# Altium project B100AA Development Kit.PrjPcb (part 1 of 5)
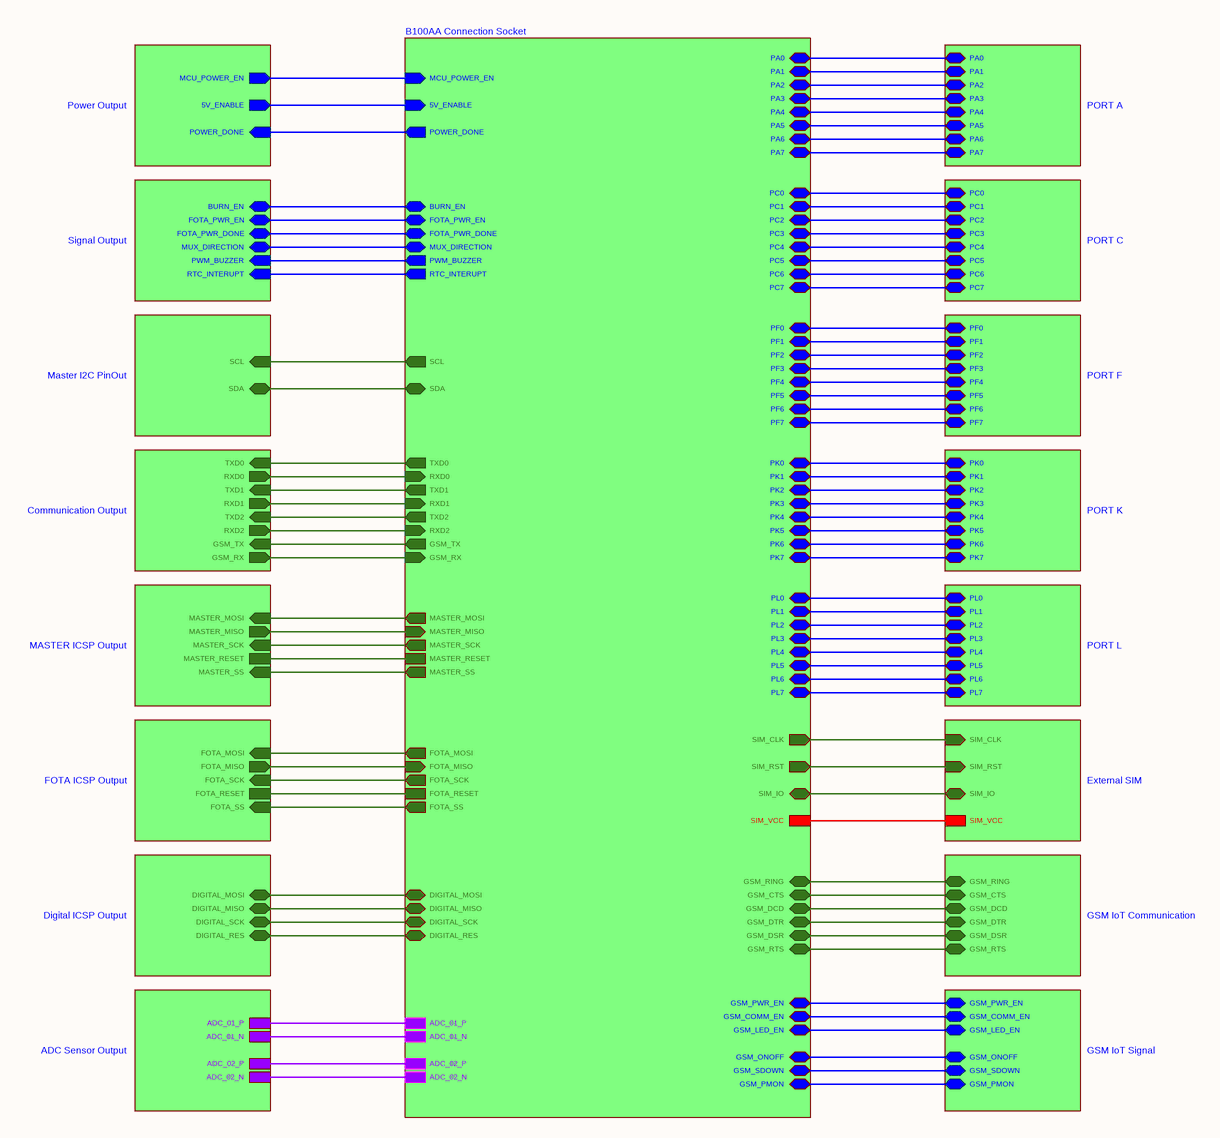
[diagram p0: Block Diagram.SchDoc]
Revision_: B100AA Dev Kit; Organization_: Ovoo Electronics; link: http://www.ovoo.me; Engineer_: Mehmet Günce Akkoyun; DocumentNumber_Prototype_: AA001_Prototype; DocumentNumber_Bulk_: AA001_Bulk; DocumentNumber_: AA001; Address4_: Turkiye; Address3_: Meram / Konya; Address2_: Birgül Apt. No: 19/6; Address1_: Necip Fazýl Mah. Ortaýrmak Sok.
40 sheets, 542 parts. Net scope: hierarchical (ports join the sheet entries above them; power ports are global).
Board file: B100AA DevKit R1.PcbDoc
Sheets:
  Block Diagram.SchDoc
    B100AA Connection Socket = Connection Socket.SchDoc
    PORT A = Digital Port A.SchDoc
      Default State DIP = Digital Port A Default State DIP.SchDoc
      State LED Inducator = Digital Port A State LED Inducator.SchDoc
      State Change Buttons = Digital Port A Button.SchDoc
    PORT C = Digital Port C.SchDoc
      Default State DIP = Digital Port C Default State DIP.SchDoc
      State LED Inducator = Digital Port C State LED Inducator.SchDoc
      State Change Buttons = Digital Port C Button.SchDoc
    PORT F = Digital Port F.SchDoc
      Default State DIP = Digital Port F Default State DIP.SchDoc
      State LED Inducator = Digital Port F State LED Inducator.SchDoc
      State Change Buttons = Digital Port F Button.SchDoc
    PORT K = Digital Port K.SchDoc
      Default State DIP = Digital Port K Default State DIP.SchDoc
      State LED Inducator = Digital Port K State LED Inducator.SchDoc
      State Change Buttons = Digital Port K Button.SchDoc
    PORT L = Digital Port L.SchDoc
      Default State DIP = Digital Port L Default State DIP.SchDoc
      State LED Inducator = Digital Port L State LED Inducator.SchDoc
      State Change Buttons = Digital Port L Button.SchDoc
    External SIM = External SIM Tray.SchDoc
    GSM IoT Communication = GSM Communication Signals.SchDoc
    GSM IoT Signal = GSM Control Signals.SchDoc
    ADC Sensor Output = ADS Sensor Sockets.SchDoc
    Digital ICSP Output = Digital ICSP Test Points.SchDoc
    MASTER ICSP Output = Master MCU ICSP Communication.SchDoc
    Communication Output = UART Communication.SchDoc
    Signal Output = Signal Outputs.SchDoc
    Power Output = Power Network.SchDoc
      Power LED Inducators = Power LED Inducators.SchDoc
      3V3 LDO Regulator = 3V3 LDO Regulator.SchDoc
      Power Test Outputs = Power Test Pins.SchDoc
      External Power Feed = External Power Feed.SchDoc
      Sleep Timer = Sleep Timer.SchDoc
      5V Enable = 5V Enable.SchDoc
      Power Switch = Power Switch.SchDoc
    FOTA ICSP Output = FOTA MCU ICSP Communication.SchDoc
    Master I2C PinOut = I2C PinOut.SchDoc

## Sheet Block Diagram.SchDoc: B100AA Development Kit Block Diagram
size A3; ApprovedBy: Mehmet Günce Akkoyun; CheckedBy: Mehmet Günce Akkoyun; Author: Mehmet Günce Akkoyun; CompanyName: Ovoo Electronics; DrawnBy: Mehmet Günce Akkoyun; Engineer: Mehmet Günce Akkoyun; Organization: Ovoo Electronics; Address1: Necip Fazýl Mah. Ortaýrmak Sok.; Address2: Birgül Apt. No: 19/6; Address3: Meram / Konya; Address4: Turkiye; DocumentNumber: AA001; Revision: B100AA Dev Kit

### Sub-sheets
ADC Sensor Output = ADS Sensor Sockets.SchDoc: ADC_01_N, ADC_02_N, ADC_02_P, ADC_01_P
B100AA Connection Socket = Connection Socket.SchDoc: GSM_COMM_EN (bidir), PC6 (bidir), PF1 (bidir), PF3 (bidir), GSM_CTS (bidir), PF0 (bidir), GSM_TX (out), GSM_RX (in), PA6 (bidir), GSM_PMON (bidir), PK5 (bidir), PF2 (bidir), GSM_RING (bidir), ADC_01_P, PA5 (bidir), PL1 (bidir), PL2 (bidir), GSM_DCD (bidir), GSM_DTR (bidir), BURN_EN (bidir), PA4 (bidir), PA3 (bidir), PK0 (bidir), PC4 (bidir), GSM_DSR (bidir), ADC_02_P, GSM_LED_EN (bidir), ADC_02_N, PF7 (bidir), TXD1 (out), PK2 (bidir), SIM_CLK (out), DIGITAL_SCK (bidir), GSM_RTS (bidir), SIM_RST (out), PL4 (bidir), GSM_PWR_EN (bidir), GSM_ONOFF (bidir), PA1 (bidir), PK1 (bidir), PK4 (bidir), PF6 (bidir), PL5 (bidir), PF5 (bidir), SIM_IO (bidir), PK6 (bidir), FOTA_MISO (in), PK7 (bidir), SCL (out), ADC_01_N, SDA (bidir), PC3 (bidir), PC1 (bidir), PL7 (bidir), PC2 (bidir), PL6 (bidir), PK3 (bidir), DIGITAL_MOSI (bidir), PA2 (bidir), FOTA_PWR_DONE (bidir), FOTA_PWR_EN (bidir), PL3 (bidir), RXD2 (in), PWM_BUZZER (out), MUX_DIRECTION (bidir), SIM_VCC, 5V_ENABLE (in), PC7 (bidir), GSM_SDOWN (bidir), PA0 (bidir), RTC_INTERUPT (out), DIGITAL_MISO (bidir), PA7 (bidir), RXD1 (in), TXD2 (out), RXD0 (in), TXD0 (out), PC0 (bidir), PF4 (bidir), DIGITAL_RES (bidir), PL0 (bidir), MCU_POWER_EN (in), FOTA_MOSI (out), PC5 (bidir), POWER_DONE (out), FOTA_SS (out), FOTA_SCK (out), FOTA_RESET, MASTER_MISO (in), MASTER_RESET, MASTER_MOSI (out), MASTER_SCK (out), MASTER_SS (out)
Communication Output = UART Communication.SchDoc: TXD2 (in), RXD1 (out), RXD2 (out), GSM_RX (out), GSM_TX (in), TXD0 (in), TXD1 (in), RXD0 (out)
Digital ICSP Output = Digital ICSP Test Points.SchDoc: DIGITAL_SCK (bidir), DIGITAL_MISO (bidir), DIGITAL_RES (bidir), DIGITAL_MOSI (bidir)
External SIM = External SIM Tray.SchDoc: SIM_IO (bidir), SIM_VCC, SIM_CLK (in), SIM_RST (in)
FOTA ICSP Output = FOTA MCU ICSP Communication.SchDoc: FOTA_MISO (out), FOTA_MOSI (in), FOTA_RESET, FOTA_SCK (in), FOTA_SS (in)
GSM IoT Communication = GSM Communication Signals.SchDoc: GSM_DSR (bidir), GSM_RING (bidir), GSM_DCD (bidir), GSM_DTR (bidir), GSM_CTS (bidir), GSM_RTS (bidir)
GSM IoT Signal = GSM Control Signals.SchDoc: GSM_COMM_EN (bidir), GSM_LED_EN (bidir), GSM_SDOWN (bidir), GSM_PMON (bidir), GSM_ONOFF (bidir), GSM_PWR_EN (bidir)
Master I2C PinOut = I2C PinOut.SchDoc: SCL (in), SDA (bidir)
MASTER ICSP Output = Master MCU ICSP Communication.SchDoc: MASTER_MISO (out), MASTER_SCK (in), MASTER_MOSI (in), MASTER_SS (in), MASTER_RESET
PORT A = Digital Port A.SchDoc: PA7 (bidir), PA2 (bidir), PA5 (bidir), PA6 (bidir), PA1 (bidir), PA3 (bidir), PA4 (bidir), PA0 (bidir)
PORT C = Digital Port C.SchDoc: PC7 (bidir), PC2 (bidir), PC5 (bidir), PC6 (bidir), PC1 (bidir), PC3 (bidir), PC4 (bidir), PC0 (bidir)
PORT F = Digital Port F.SchDoc: PF7 (bidir), PF2 (bidir), PF5 (bidir), PF6 (bidir), PF1 (bidir), PF3 (bidir), PF4 (bidir), PF0 (bidir)
PORT K = Digital Port K.SchDoc: PK7 (bidir), PK2 (bidir), PK5 (bidir), PK6 (bidir), PK1 (bidir), PK3 (bidir), PK4 (bidir), PK0 (bidir)
PORT L = Digital Port L.SchDoc: PL7 (bidir), PL2 (bidir), PL5 (bidir), PL6 (bidir), PL1 (bidir), PL3 (bidir), PL4 (bidir), PL0 (bidir)
Power Output = Power Network.SchDoc: MCU_POWER_EN (out), POWER_DONE (in), 5V_ENABLE (out)
Signal Output = Signal Outputs.SchDoc: FOTA_PWR_DONE (bidir), MUX_DIRECTION (bidir), FOTA_PWR_EN (bidir), RTC_INTERUPT (in), BURN_EN (bidir), PWM_BUZZER (in)

### Nets
BURN_EN: sheet B100AA Connection Socket/BURN_EN, sheet Signal Output/BURN_EN
FOTA_MISO: sheet B100AA Connection Socket/FOTA_MISO, sheet FOTA ICSP Output/FOTA_MISO
FOTA_MOSI: sheet B100AA Connection Socket/FOTA_MOSI, sheet FOTA ICSP Output/FOTA_MOSI
FOTA_PWR_DONE: sheet B100AA Connection Socket/FOTA_PWR_DONE, sheet Signal Output/FOTA_PWR_DONE
FOTA_PWR_EN: sheet B100AA Connection Socket/FOTA_PWR_EN, sheet Signal Output/FOTA_PWR_EN
FOTA_RESET: sheet B100AA Connection Socket/FOTA_RESET, sheet FOTA ICSP Output/FOTA_RESET
FOTA_SCK: sheet B100AA Connection Socket/FOTA_SCK, sheet FOTA ICSP Output/FOTA_SCK
FOTA_SS: sheet B100AA Connection Socket/FOTA_SS, sheet FOTA ICSP Output/FOTA_SS
GSM_COMM_EN: sheet B100AA Connection Socket/GSM_COMM_EN, sheet GSM IoT Signal/GSM_COMM_EN
GSM_CTS: sheet B100AA Connection Socket/GSM_CTS, sheet GSM IoT Communication/GSM_CTS
GSM_DCD: sheet B100AA Connection Socket/GSM_DCD, sheet GSM IoT Communication/GSM_DCD
GSM_DSR: sheet B100AA Connection Socket/GSM_DSR, sheet GSM IoT Communication/GSM_DSR
GSM_DTR: sheet B100AA Connection Socket/GSM_DTR, sheet GSM IoT Communication/GSM_DTR
GSM_LED_EN: sheet B100AA Connection Socket/GSM_LED_EN, sheet GSM IoT Signal/GSM_LED_EN
GSM_PWR_EN: sheet B100AA Connection Socket/GSM_PWR_EN, sheet GSM IoT Signal/GSM_PWR_EN
GSM_RING: sheet B100AA Connection Socket/GSM_RING, sheet GSM IoT Communication/GSM_RING
GSM_RTS: sheet B100AA Connection Socket/GSM_RTS, sheet GSM IoT Communication/GSM_RTS
MASTER_MISO: sheet B100AA Connection Socket/MASTER_MISO, sheet MASTER ICSP Output/MASTER_MISO
MASTER_MOSI: sheet B100AA Connection Socket/MASTER_MOSI, sheet MASTER ICSP Output/MASTER_MOSI
MASTER_RESET: sheet B100AA Connection Socket/MASTER_RESET, sheet MASTER ICSP Output/MASTER_RESET
MASTER_SCK: sheet B100AA Connection Socket/MASTER_SCK, sheet MASTER ICSP Output/MASTER_SCK
MASTER_SS: sheet B100AA Connection Socket/MASTER_SS, sheet MASTER ICSP Output/MASTER_SS
MCU_POWER_EN: sheet B100AA Connection Socket/MCU_POWER_EN, sheet Power Output/MCU_POWER_EN
MUX_DIRECTION: sheet B100AA Connection Socket/MUX_DIRECTION, sheet Signal Output/MUX_DIRECTION
PA0: sheet B100AA Connection Socket/PA0, sheet PORT A/PA0
PA1: sheet B100AA Connection Socket/PA1, sheet PORT A/PA1
PA2: sheet B100AA Connection Socket/PA2, sheet PORT A/PA2
PA3: sheet B100AA Connection Socket/PA3, sheet PORT A/PA3
PA4: sheet B100AA Connection Socket/PA4, sheet PORT A/PA4
PA5: sheet B100AA Connection Socket/PA5, sheet PORT A/PA5
PA6: sheet B100AA Connection Socket/PA6, sheet PORT A/PA6
PA7: sheet B100AA Connection Socket/PA7, sheet PORT A/PA7
PC0: sheet B100AA Connection Socket/PC0, sheet PORT C/PC0
PC1: sheet B100AA Connection Socket/PC1, sheet PORT C/PC1
PC2: sheet B100AA Connection Socket/PC2, sheet PORT C/PC2
PC3: sheet B100AA Connection Socket/PC3, sheet PORT C/PC3
PC4: sheet B100AA Connection Socket/PC4, sheet PORT C/PC4
PC5: sheet B100AA Connection Socket/PC5, sheet PORT C/PC5
PC6: sheet B100AA Connection Socket/PC6, sheet PORT C/PC6
PC7: sheet B100AA Connection Socket/PC7, sheet PORT C/PC7
PF0: sheet B100AA Connection Socket/PF0, sheet PORT F/PF0
PF1: sheet B100AA Connection Socket/PF1, sheet PORT F/PF1
PF2: sheet B100AA Connection Socket/PF2, sheet PORT F/PF2
PF3: sheet B100AA Connection Socket/PF3, sheet PORT F/PF3
PF4: sheet B100AA Connection Socket/PF4, sheet PORT F/PF4
PF5: sheet B100AA Connection Socket/PF5, sheet PORT F/PF5
PF6: sheet B100AA Connection Socket/PF6, sheet PORT F/PF6
PF7: sheet B100AA Connection Socket/PF7, sheet PORT F/PF7
PK0: sheet B100AA Connection Socket/PK0, sheet PORT K/PK0
PK1: sheet B100AA Connection Socket/PK1, sheet PORT K/PK1
PK2: sheet B100AA Connection Socket/PK2, sheet PORT K/PK2
PK3: sheet B100AA Connection Socket/PK3, sheet PORT K/PK3
PK4: sheet B100AA Connection Socket/PK4, sheet PORT K/PK4
PK5: sheet B100AA Connection Socket/PK5, sheet PORT K/PK5
PK6: sheet B100AA Connection Socket/PK6, sheet PORT K/PK6
PK7: sheet B100AA Connection Socket/PK7, sheet PORT K/PK7
PL0: sheet B100AA Connection Socket/PL0, sheet PORT L/PL0
PL1: sheet B100AA Connection Socket/PL1, sheet PORT L/PL1
PL2: sheet B100AA Connection Socket/PL2, sheet PORT L/PL2
PL3: sheet B100AA Connection Socket/PL3, sheet PORT L/PL3
PL4: sheet B100AA Connection Socket/PL4, sheet PORT L/PL4
PL5: sheet B100AA Connection Socket/PL5, sheet PORT L/PL5
PL6: sheet B100AA Connection Socket/PL6, sheet PORT L/PL6
PL7: sheet B100AA Connection Socket/PL7, sheet PORT L/PL7
POWER_DONE: sheet B100AA Connection Socket/POWER_DONE, sheet Power Output/POWER_DONE
RTC_INTERUPT: sheet B100AA Connection Socket/RTC_INTERUPT, sheet Signal Output/RTC_INTERUPT
NetC24_2: sheet B100AA Connection Socket/5V_ENABLE, sheet Power Output/5V_ENABLE
NetC56_2: sheet B100AA Connection Socket/SIM_VCC, sheet External SIM/SIM_VCC
NetC62_2: sheet B100AA Connection Socket/SIM_RST, sheet External SIM/SIM_RST
NetC64_2: sheet B100AA Connection Socket/SIM_CLK, sheet External SIM/SIM_CLK
NetC70_2: sheet B100AA Connection Socket/SIM_IO, sheet External SIM/SIM_IO
NetC111_1: sheet B100AA Connection Socket/GSM_PMON, sheet GSM IoT Signal/GSM_PMON
NetC112_1: sheet B100AA Connection Socket/GSM_SDOWN, sheet GSM IoT Signal/GSM_SDOWN
NetC113_1: sheet B100AA Connection Socket/GSM_ONOFF, sheet GSM IoT Signal/GSM_ONOFF
NetJ5_3: sheet B100AA Connection Socket/ADC_01_P, sheet ADC Sensor Output/ADC_01_P
NetJ5_4: sheet B100AA Connection Socket/ADC_01_N, sheet ADC Sensor Output/ADC_01_N
NetJ6_3: sheet B100AA Connection Socket/ADC_02_P, sheet ADC Sensor Output/ADC_02_P
NetJ6_4: sheet B100AA Connection Socket/ADC_02_N, sheet ADC Sensor Output/ADC_02_N
NetJ7_35: sheet B100AA Connection Socket/TXD0, sheet Communication Output/TXD0
NetJ7_36: sheet B100AA Connection Socket/RXD0, sheet Communication Output/RXD0
NetJ7_37: sheet B100AA Connection Socket/TXD1, sheet Communication Output/TXD1
NetJ7_38: sheet B100AA Connection Socket/RXD1, sheet Communication Output/RXD1
NetJ7_39: sheet B100AA Connection Socket/TXD2, sheet Communication Output/TXD2
NetJ7_40: sheet B100AA Connection Socket/RXD2, sheet Communication Output/RXD2
NetJ7_45: sheet B100AA Connection Socket/SCL, sheet Master I2C PinOut/SCL
NetJ7_46: sheet B100AA Connection Socket/SDA, sheet Master I2C PinOut/SDA
NetJ7_48: sheet B100AA Connection Socket/PWM_BUZZER, sheet Signal Output/PWM_BUZZER
NetJ12_43: sheet B100AA Connection Socket/DIGITAL_RES, sheet Digital ICSP Output/DIGITAL_RES
NetJ12_44: sheet B100AA Connection Socket/DIGITAL_SCK, sheet Digital ICSP Output/DIGITAL_SCK
NetJ12_45: sheet B100AA Connection Socket/DIGITAL_MOSI, sheet Digital ICSP Output/DIGITAL_MOSI
NetJ12_46: sheet B100AA Connection Socket/DIGITAL_MISO, sheet Digital ICSP Output/DIGITAL_MISO
NetJ12_56: sheet B100AA Connection Socket/GSM_TX, sheet Communication Output/GSM_TX
NetJ12_57: sheet B100AA Connection Socket/GSM_RX, sheet Communication Output/GSM_RX

### Notes on the sheet
- Title
- Size:
- Date:
- A3
- Number:
- Time:
- Revision:
- Sheet
- of
- File:

## Sheet Connection Socket.SchDoc: B100AA Connection Socket
size A3; ApprovedBy: Mehmet Günce Akkoyun; CheckedBy: Mehmet Günce Akkoyun; Author: Mehmet Günce Akkoyun; CompanyName: Ovoo Electronics; DrawnBy: Mehmet Günce Akkoyun; Engineer: Mehmet Günce Akkoyun; Organization: Ovoo Electronics; Address1: Necip Fazýl Mah. Ortaýrmak Sok.; Address2: Birgül Apt. No: 19/6; Address3: Meram / Konya; Address4: Turkiye; DocumentNumber: AA001; Revision: B100AA Dev Kit
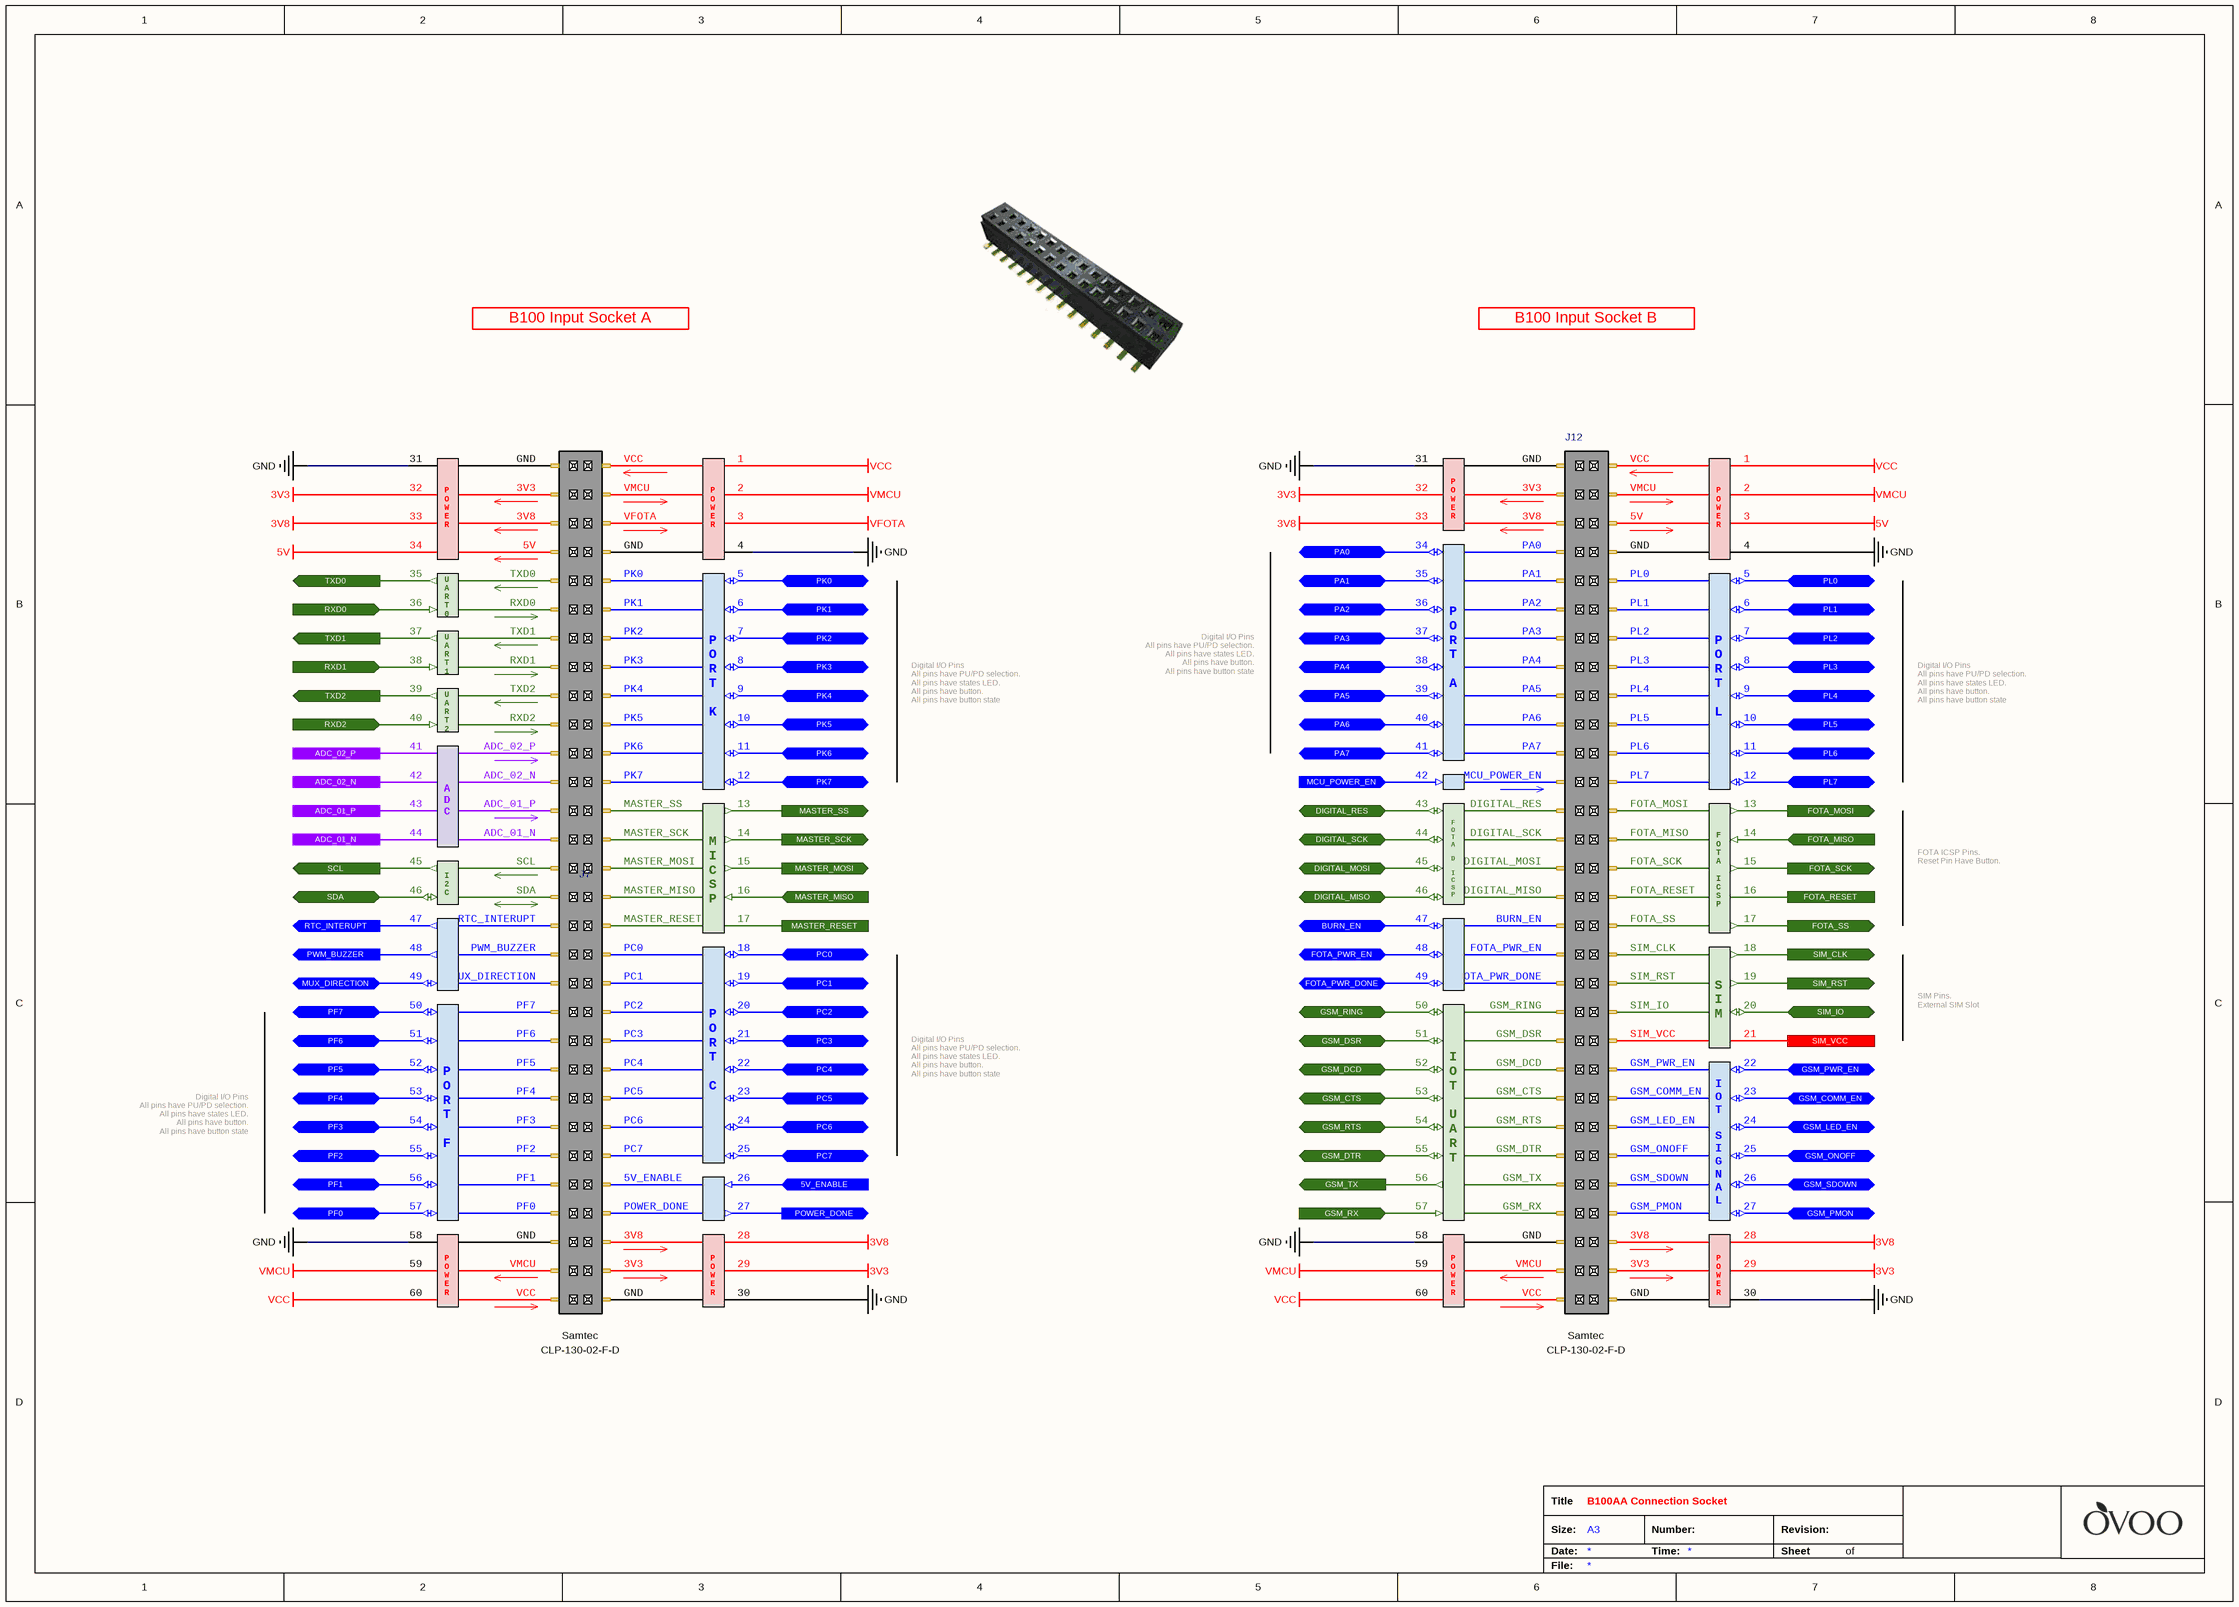
[diagram p1: Connection Socket.SchDoc]

### Parts
J7  Manufacturer Part Number: CLP-130-02-F-D  Manufacturer Name: Samtec  [SAMTEC-CLP-130-02-X-D]  (hidden comment: 1.27 mm Pitch 2x30P Female Connector)
J12  Manufacturer Part Number: CLP-130-02-F-D  Manufacturer Name: Samtec  [SAMTEC-CLP-130-02-X-D]  (hidden comment: 1.27 mm Pitch 2x30P Female Connector)

### Ports
5V_ENABLE (in), ADC_01_N, ADC_01_P, ADC_02_N, ADC_02_P, BURN_EN (bidir), DIGITAL_MISO (bidir), DIGITAL_MOSI (bidir), DIGITAL_RES (bidir), DIGITAL_SCK (bidir), FOTA_MISO (in), FOTA_MOSI (out), FOTA_PWR_DONE (bidir), FOTA_PWR_EN (bidir), FOTA_RESET, FOTA_SCK (out), FOTA_SS (out), GSM_COMM_EN (bidir), GSM_CTS (bidir), GSM_DCD (bidir), GSM_DSR (bidir), GSM_DTR (bidir), GSM_LED_EN (bidir), GSM_ONOFF (bidir), GSM_PMON (bidir), GSM_PWR_EN (bidir), GSM_RING (bidir), GSM_RTS (bidir), GSM_RX (in), GSM_SDOWN (bidir), GSM_TX (out), MASTER_MISO (in), MASTER_MOSI (out), MASTER_RESET, MASTER_SCK (out), MASTER_SS (out), MCU_POWER_EN (in), MUX_DIRECTION (bidir), PA0 (bidir), PA1 (bidir), PA2 (bidir), PA3 (bidir), PA4 (bidir), PA5 (bidir), PA6 (bidir), PA7 (bidir), PC0 (bidir), PC1 (bidir), PC2 (bidir), PC3 (bidir), PC4 (bidir), PC5 (bidir), PC6 (bidir), PC7 (bidir), PF0 (bidir), PF1 (bidir), PF2 (bidir), PF3 (bidir), PF4 (bidir), PF5 (bidir), PF6 (bidir), PF7 (bidir), PK0 (bidir), PK1 (bidir), PK2 (bidir), PK3 (bidir), PK4 (bidir), PK5 (bidir), PK6 (bidir), PK7 (bidir), PL0 (bidir), PL1 (bidir), PL2 (bidir), PL3 (bidir), PL4 (bidir), PL5 (bidir), PL6 (bidir), PL7 (bidir), POWER_DONE (out), PWM_BUZZER (out), RTC_INTERUPT (out), RXD0 (in), RXD1 (in), RXD2 (in), SCL (out), SDA (bidir), SIM_CLK (out), SIM_IO (bidir), SIM_RST (out), SIM_VCC, TXD0 (out), TXD1 (out), TXD2 (out)

### Nets
3V3: J7.29(Pin-29) J7.32(Pin-32) J12.29(Pin-29) J12.32(Pin-32)
3V8: J7.28(Pin-28) J7.33(Pin-33) J12.28(Pin-28) J12.33(Pin-33)
5V: J7.34(Pin-34) J12.3(Pin-3)
GND: J7.4(Pin-4) J7.30(Pin-30) J7.31(Pin-31) J7.58(Pin-58) J12.4(Pin-4) J12.30(Pin-30) J12.31(Pin-31) J12.58(Pin-58)
VCC: J7.1(Pin-1) J7.60(Pin-60) J12.1(Pin-1) J12.60(Pin-60)
VFOTA: J7.3(Pin-3)
VMCU: J7.2(Pin-2) J7.59(Pin-59) J12.2(Pin-2) J12.59(Pin-59)
BURN_EN: J12.47(Pin-47) ; port BURN_EN
FOTA_MISO: J12.14(Pin-14) ; port FOTA_MISO
FOTA_MOSI: J12.13(Pin-13) ; port FOTA_MOSI
FOTA_PWR_DONE: J12.49(Pin-49) ; port FOTA_PWR_DONE
FOTA_PWR_EN: J12.48(Pin-48) ; port FOTA_PWR_EN
FOTA_RESET: J12.16(Pin-16) ; port FOTA_RESET
FOTA_SCK: J12.15(Pin-15) ; port FOTA_SCK
FOTA_SS: J12.17(Pin-17) ; port FOTA_SS
GSM_COMM_EN: J12.23(Pin-23) ; port GSM_COMM_EN
GSM_CTS: J12.53(Pin-53) ; port GSM_CTS
GSM_DCD: J12.52(Pin-52) ; port GSM_DCD
GSM_DSR: J12.51(Pin-51) ; port GSM_DSR
GSM_DTR: J12.55(Pin-55) ; port GSM_DTR
GSM_LED_EN: J12.24(Pin-24) ; port GSM_LED_EN
GSM_PWR_EN: J12.22(Pin-22) ; port GSM_PWR_EN
GSM_RING: J12.50(Pin-50) ; port GSM_RING
GSM_RTS: J12.54(Pin-54) ; port GSM_RTS
MASTER_MISO: J7.16(Pin-16) ; port MASTER_MISO
MASTER_MOSI: J7.15(Pin-15) ; port MASTER_MOSI
MASTER_RESET: J7.17(Pin-17) ; port MASTER_RESET
MASTER_SCK: J7.14(Pin-14) ; port MASTER_SCK
MASTER_SS: J7.13(Pin-13) ; port MASTER_SS
MCU_POWER_EN: J12.42(Pin-42) ; port MCU_POWER_EN
MUX_DIRECTION: J7.49(Pin-49) ; port MUX_DIRECTION
PA0: J12.34(Pin-34) ; port PA0
PA1: J12.35(Pin-35) ; port PA1
PA2: J12.36(Pin-36) ; port PA2
PA3: J12.37(Pin-37) ; port PA3
PA4: J12.38(Pin-38) ; port PA4
PA5: J12.39(Pin-39) ; port PA5
PA6: J12.40(Pin-40) ; port PA6
PA7: J12.41(Pin-41) ; port PA7
PC0: J7.18(Pin-18) ; port PC0
PC1: J7.19(Pin-19) ; port PC1
PC2: J7.20(Pin-20) ; port PC2
PC3: J7.21(Pin-21) ; port PC3
PC4: J7.22(Pin-22) ; port PC4
PC5: J7.23(Pin-23) ; port PC5
PC6: J7.24(Pin-24) ; port PC6
PC7: J7.25(Pin-25) ; port PC7
PF0: J7.57(Pin-57) ; port PF0
PF1: J7.56(Pin-56) ; port PF1
PF2: J7.55(Pin-55) ; port PF2
PF3: J7.54(Pin-54) ; port PF3
PF4: J7.53(Pin-53) ; port PF4
PF5: J7.52(Pin-52) ; port PF5
PF6: J7.51(Pin-51) ; port PF6
PF7: J7.50(Pin-50) ; port PF7
PK0: J7.5(Pin-5) ; port PK0
PK1: J7.6(Pin-6) ; port PK1
PK2: J7.7(Pin-7) ; port PK2
PK3: J7.8(Pin-8) ; port PK3
PK4: J7.9(Pin-9) ; port PK4
PK5: J7.10(Pin-10) ; port PK5
PK6: J7.11(Pin-11) ; port PK6
PK7: J7.12(Pin-12) ; port PK7
PL0: J12.5(Pin-5) ; port PL0
PL1: J12.6(Pin-6) ; port PL1
PL2: J12.7(Pin-7) ; port PL2
PL3: J12.8(Pin-8) ; port PL3
PL4: J12.9(Pin-9) ; port PL4
PL5: J12.10(Pin-10) ; port PL5
PL6: J12.11(Pin-11) ; port PL6
PL7: J12.12(Pin-12) ; port PL7
POWER_DONE: J7.27(Pin-27) ; port POWER_DONE
RTC_INTERUPT: J7.47(Pin-47) ; port RTC_INTERUPT
NetC24_2: J7.26(Pin-26) ; port 5V_ENABLE
NetC56_2: J12.21(Pin-21) ; port SIM_VCC
NetC62_2: J12.19(Pin-19) ; port SIM_RST
NetC64_2: J12.18(Pin-18) ; port SIM_CLK
NetC70_2: J12.20(Pin-20) ; port SIM_IO
NetC111_1: J12.27(Pin-27) ; port GSM_PMON
NetC112_1: J12.26(Pin-26) ; port GSM_SDOWN
NetC113_1: J12.25(Pin-25) ; port GSM_ONOFF
NetJ5_3: J7.43(Pin-43) ; port ADC_01_P
NetJ5_4: J7.44(Pin-44) ; port ADC_01_N
NetJ6_3: J7.41(Pin-41) ; port ADC_02_P
NetJ6_4: J7.42(Pin-42) ; port ADC_02_N
NetJ7_35: J7.35(Pin-35) ; port TXD0
NetJ7_36: J7.36(Pin-36) ; port RXD0
NetJ7_37: J7.37(Pin-37) ; port TXD1
NetJ7_38: J7.38(Pin-38) ; port RXD1
NetJ7_39: J7.39(Pin-39) ; port TXD2
NetJ7_40: J7.40(Pin-40) ; port RXD2
NetJ7_45: J7.45(Pin-45) ; port SCL
NetJ7_46: J7.46(Pin-46) ; port SDA
NetJ7_48: J7.48(Pin-48) ; port PWM_BUZZER
NetJ12_43: J12.43(Pin-43) ; port DIGITAL_RES
NetJ12_44: J12.44(Pin-44) ; port DIGITAL_SCK
NetJ12_45: J12.45(Pin-45) ; port DIGITAL_MOSI
NetJ12_46: J12.46(Pin-46) ; port DIGITAL_MISO
NetJ12_56: J12.56(Pin-56) ; port GSM_TX
NetJ12_57: J12.57(Pin-57) ; port GSM_RX

### Notes on the sheet
- B100 Input Socket A
- B100 Input Socket B
- Digital I/O Pins
  All pins have PU/PD selection.
  All pins have states LED.
  All pins have button.
  All pins have button state selection.
- FOTA ICSP Pins.
  Reset Pin Have Button.
- SIM Pins.
  External SIM Slot
- Title
- Size:
- Date:
- A3
- Number:
- Time:
- Revision:
- Sheet
- of
- File:
- (in symbol Connector - B100 Female Socket [A]) GND; VCC; 3V3; VMCU; 3V8; VFOTA; 5V; / P / O / W / E / R; TXD0; PK0; RXD0; PK1; U / A / R / T / 0; TXD1; PK2; RXD1; PK3; U / A / R / T / 1; TXD2; PK4; RXD2; PK5; U / A / R / T / 2; ADC_02_P; PK6; ADC_02_N; PK7; / P / O / R / T / K; ADC_01_P; MASTER_SS; ADC_01_N; MASTER_SCK; / A / D / C; SCL; MASTER_MOSI; SDA; MASTER_MISO; / I / 2 / C; RTC_INTERUPT; MASTER_RESET; / M / I / C / S / P; PWM_BUZZER; PC0; MUX_DIRECTION; PC1; PF7; PC2; PF6; PC3; PF5; PC4; PF4; PC5; PF3; PC6; PF2; PC7; / P / O / R / T / C; PF1; 5V_ENABLE; PF0; POWER_DONE; / P / O / R / T / F
- (in symbol Connector - B100 Female Socket [B]) GND; VCC; 3V3; VMCU; 3V8; 5V; / P / O / W / E / R; PA0; PA1; PL0; PA2; PL1; PA3; PL2; PA4; PL3; PA5; PL4; PA6; PL5; PA7; PL6; / P / O / R / T / A; MCU_POWER_EN; PL7; / P / O / R / T / L; DIGITAL_RES; FOTA_MOSI; DIGITAL_SCK; FOTA_MISO; DIGITAL_MOSI; FOTA_SCK; DIGITAL_MISO; FOTA_RESET; / F / O / T / A / D / I / C / S / P; BURN_EN; FOTA_SS; / F / O / T / A / I / C / S / P; FOTA_PWR_EN; SIM_CLK; FOTA_PWR_DONE; SIM_RST; GSM_RING; SIM_IO; GSM_DSR; SIM_VCC; / S / I / M; GSM_DCD; GSM_PWR_EN; GSM_CTS; GSM_COMM_EN; GSM_RTS; GSM_LED_EN; GSM_DTR; GSM_ONOFF; GSM_TX; GSM_SDOWN; GSM_RX; GSM_PMON; / I / O / T / U / A / R / T; / I / O / T / S / I / G / N / A / L

### Library data of the parts
J7 = Connector - B100 Female Socket [A]: Headers & Wire Housings BREAKAWAY HDR VERT 60; Position: 60; Row: 2; Pitch: 1.27 mm; Mouser Part Number: 200-CLP13002FD; ROHS: Yes; ComponentLink1Description: DataSheet; ComponentLink1URL: https://www.mouser.com.tr/datasheet/2/527/clp_sm-1369947.pdf; ComponentLink2Description: Mouser; ComponentLink2URL: https://www.mouser.com.tr/ProductDetail/Samtec/CLP-130-02-F-D/?qs=0lQeLiL1qybc%2FxML5BDomw%3D%3D; Supplier 1: Mouser; Supplier Part Number 1: 200-CLP13002FD; System: Connector
J12 = Connector - B100 Female Socket [B]: Headers & Wire Housings BREAKAWAY HDR VERT 60; Position: 60; Row: 2; Pitch: 1.27 mm; Mouser Part Number: 200-CLP13002FD; ROHS: Yes; ComponentLink1Description: DataSheet; ComponentLink1URL: https://www.mouser.com.tr/datasheet/2/527/clp_sm-1369947.pdf; ComponentLink2Description: Mouser; ComponentLink2URL: https://www.mouser.com.tr/ProductDetail/Samtec/CLP-130-02-F-D/?qs=0lQeLiL1qybc%2FxML5BDomw%3D%3D; Supplier 1: Mouser; Supplier Part Number 1: 200-CLP13002FD; System: Connector

## Sheet Digital Port A.SchDoc: Port A Digital Control
size A4; ApprovedBy: Mehmet Günce Akkoyun; CheckedBy: Mehmet Günce Akkoyun; Author: Mehmet Günce Akkoyun; CompanyName: Ovoo Electronics; DrawnBy: Mehmet Günce Akkoyun; Engineer: Mehmet Günce Akkoyun; Organization: Ovoo Electronics; Address1: Necip Fazýl Mah. Ortaýrmak Sok.; Address2: Birgül Apt. No: 19/6; Address3: Meram / Konya; Address4: Turkiye; DocumentNumber: AA001; Revision: B100AA Dev Kit
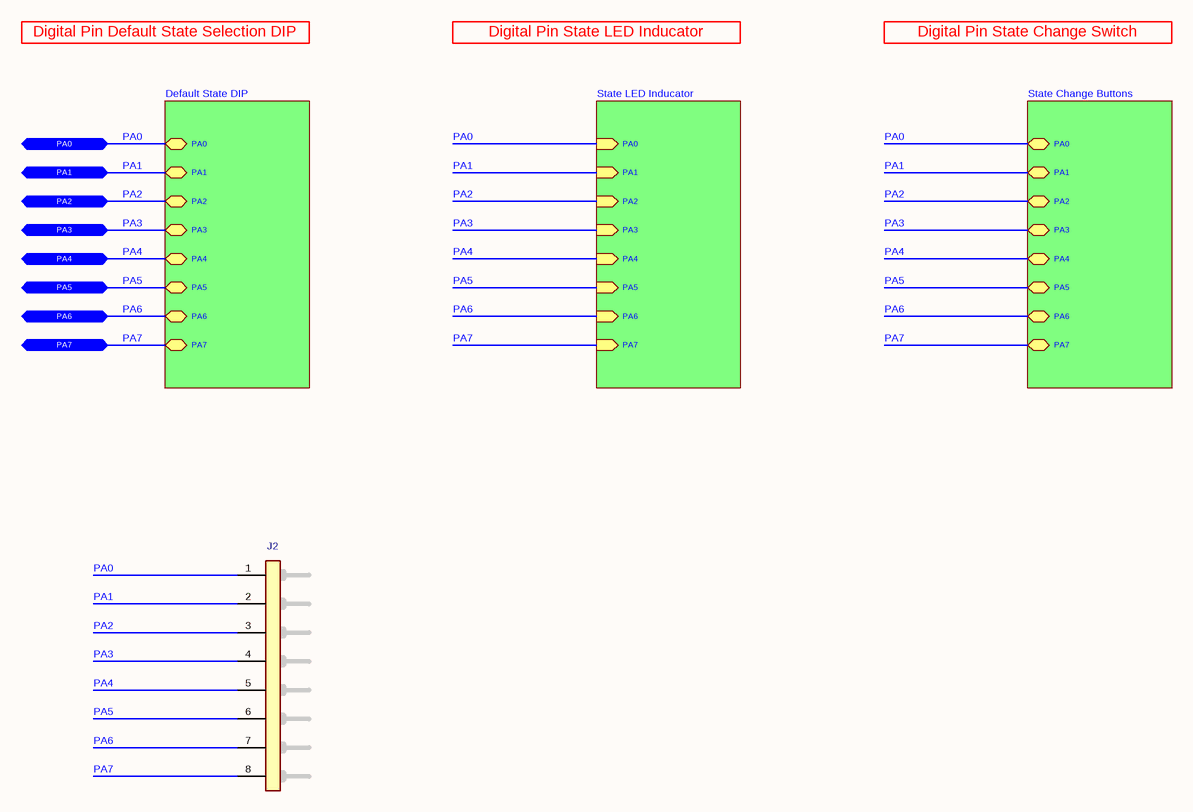
[diagram p2: Digital Port A.SchDoc]

### Parts
J2  2.54 mm Pitch 8P Male Connector  [8P Header]  (value not drawn)

### Sub-sheets
Default State DIP = Digital Port A Default State DIP.SchDoc: PA1 (bidir), PA0 (bidir), PA7 (bidir), PA4 (bidir), PA6 (bidir), PA3 (bidir), PA5 (bidir), PA2 (bidir)
State Change Buttons = Digital Port A Button.SchDoc: PA1 (bidir), PA0 (bidir), PA7 (bidir), PA4 (bidir), PA6 (bidir), PA3 (bidir), PA5 (bidir), PA2 (bidir)
State LED Inducator = Digital Port A State LED Inducator.SchDoc: PA1 (in), PA0 (in), PA7 (in), PA4 (in), PA6 (in), PA3 (in), PA5 (in), PA2 (in)

### Ports
PA0 (bidir), PA1 (bidir), PA2 (bidir), PA3 (bidir), PA4 (bidir), PA5 (bidir), PA6 (bidir), PA7 (bidir)

### Nets
PA0: J2.1(Pin-1) ; port PA0, sheet Default State DIP/PA0, sheet State LED Inducator/PA0, sheet State Change Buttons/PA0
PA1: J2.2(Pin-2) ; port PA1, sheet Default State DIP/PA1, sheet State LED Inducator/PA1, sheet State Change Buttons/PA1
PA2: J2.3(Pin-3) ; port PA2, sheet Default State DIP/PA2, sheet State LED Inducator/PA2, sheet State Change Buttons/PA2
PA3: J2.4(Pin-4) ; port PA3, sheet Default State DIP/PA3, sheet State LED Inducator/PA3, sheet State Change Buttons/PA3
PA4: J2.5(Pin-5) ; port PA4, sheet Default State DIP/PA4, sheet State LED Inducator/PA4, sheet State Change Buttons/PA4
PA5: J2.6(Pin-6) ; port PA5, sheet Default State DIP/PA5, sheet State LED Inducator/PA5, sheet State Change Buttons/PA5
PA6: J2.7(Pin-7) ; port PA6, sheet Default State DIP/PA6, sheet State LED Inducator/PA6, sheet State Change Buttons/PA6
PA7: J2.8(Pin-8) ; port PA7, sheet Default State DIP/PA7, sheet State LED Inducator/PA7, sheet State Change Buttons/PA7

### Notes on the sheet
- Digital Pin Default State Selection DIP
- Digital Pin State LED Inducator
- Digital Pin State Change Switch
- Title
- Size:
- Date:
- A4
- Number:
- Time:
- Revision:
- Sheet
- of
- File:

### Library data of the parts
J2 = Connector - Male Header 8P (2.54): Headers & Wire Housings BREAKAWAY HDR VERT 8; Manufacturer Name: Molex; Position: 8; Row: 1; Pitch: 2.54 mm; Manufacturer Part Number: 22-28-4083; Mouser Part Number: 538-22-28-4083; ROHS: Yes; ComponentLink1Description: DataSheet; ComponentLink1URL: https://www.mouser.com.tr/datasheet/2/276/0022284063_PCB_HEADERS-228265.pdf; ComponentLink2Description: Mouser; ComponentLink2URL: https://www.mouser.com.tr/ProductDetail/Molex/22-28-4083/?qs=%2Fha2pyFaduguMWEp6M%252Bj0x6fHxUvnRGD%252BIxBoa6MO5w%3D

## Sheet Digital Port A Default State DIP.SchDoc: PORT A Default State Selection Switch
size A4; ApprovedBy: Mehmet Günce Akkoyun; CheckedBy: Mehmet Günce Akkoyun; Author: Mehmet Günce Akkoyun; CompanyName: Ovoo Electronics; DrawnBy: Mehmet Günce Akkoyun; Engineer: Mehmet Günce Akkoyun; Organization: Ovoo Electronics; Address1: Necip Fazýl Mah. Ortaýrmak Sok.; Address2: Birgül Apt. No: 19/6; Address3: Meram / Konya; Address4: Turkiye; DocumentNumber: AA001; Revision: B100AA Dev Kit
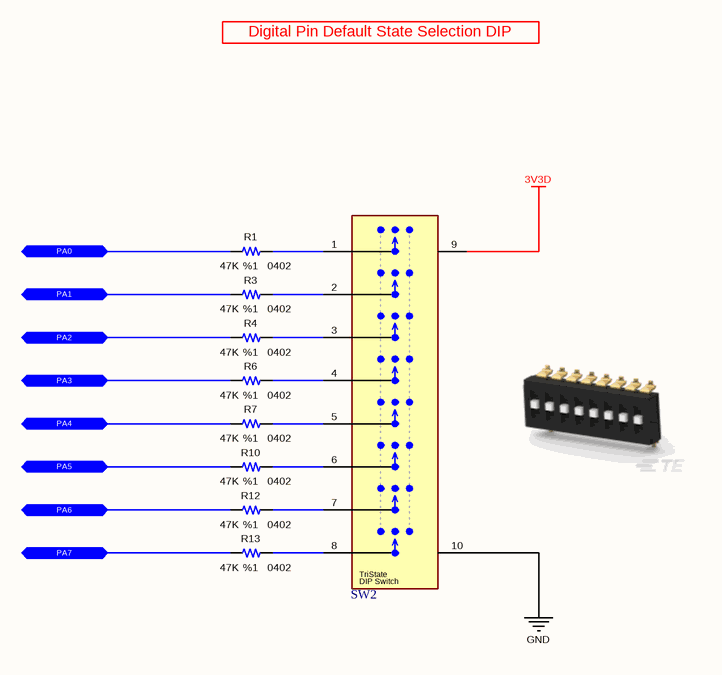
[diagram p3: Digital Port A Default State DIP.SchDoc]

### Parts
R1  value 47K  Tolerance: %1  Case: 0402  [RESISTOR_0402]  (hidden comment: Thick Film Resistor)
R3  value 47K  Tolerance: %1  Case: 0402  [RESISTOR_0402]  (hidden comment: Thick Film Resistor)
R4  value 47K  Tolerance: %1  Case: 0402  [RESISTOR_0402]  (hidden comment: Thick Film Resistor)
R6  value 47K  Tolerance: %1  Case: 0402  [RESISTOR_0402]  (hidden comment: Thick Film Resistor)
R7  value 47K  Tolerance: %1  Case: 0402  [RESISTOR_0402]  (hidden comment: Thick Film Resistor)
R10  value 47K  Tolerance: %1  Case: 0402  [RESISTOR_0402]  (hidden comment: Thick Film Resistor)
R12  value 47K  Tolerance: %1  Case: 0402  [RESISTOR_0402]  (hidden comment: Thick Film Resistor)
R13  value 47K  Tolerance: %1  Case: 0402  [RESISTOR_0402]  (hidden comment: Thick Film Resistor)
SW2  DIP Switches/SIP Switches  [TDS08SGNNTR04]  (value not drawn)

### Ports
PA0 (bidir), PA1 (bidir), PA2 (bidir), PA3 (bidir), PA4 (bidir), PA5 (bidir), PA6 (bidir), PA7 (bidir)

### Nets
3V3D: SW2.9(VCC)
GND: SW2.10(GND)
PA0: R1.2 ; port PA0
PA1: R3.2 ; port PA1
PA2: R4.2 ; port PA2
PA3: R6.2 ; port PA3
PA4: R7.2 ; port PA4
PA5: R10.2 ; port PA5
PA6: R12.2 ; port PA6
PA7: R13.2 ; port PA7
NetR1_1: R1.1 SW2.1
NetR3_1: R3.1 SW2.2
NetR4_1: R4.1 SW2.3
NetR6_1: R6.1 SW2.4
NetR7_1: R7.1 SW2.5
NetR10_1: R10.1 SW2.6
NetR12_1: R12.1 SW2.7
NetR13_1: R13.1 SW2.8

### Notes on the sheet
- Digital Pin Default State Selection DIP
- Title
- Size:
- Date:
- A4
- Number:
- Time:
- Revision:
- Sheet
- of
- File:
- (in symbol Switch - DIP Switch (8 Pole TriState)) TriState; DIP Switch

### Library data of the parts
R1 R3 R4 R6 R7 R10 R12 R13 = Resistor - 47K: Thick Film Resistors - SMD 1/16 W 47 Kohms 1%; Manufacturer Name: Vishay; Manufacturer Part Number: CRCW040247K0FKED; Height: 0.4mm; Mouser Part Number: 71-CRCW0402-47K-E3; ComponentLink1Description: DataSheet; ComponentLink1URL: https://www.mouser.com.tr/datasheet/2/427/dcrcwe3-1762152.pdf; ComponentLink2Description: Mouser; ComponentLink2URL: https://www.mouser.com.tr/ProductDetail/Vishay-Dale/CRCW040247K0FKED?qs=sGAEpiMZZMu61qfTUdNhG2DpbjADlD3GL%252B3h1elTxqU%3D; Supplier 1: Mouser; Supplier 2: Digi-Key; Supplier Part Number 1: 71-CRCW040247K0FKEDH; Supplier Part Number 2: 541-47.0KYCT-ND
SW2 = Switch - DIP Switch (8 Pole TriState): DIP Switches/SIP Switches TRI-STATE DIP 8P G RAISED T&R; Manufacturer Name: TE Connectivity; Manufacturer Part Number: TDS08SGNNTR04; Mouser Part Number: 506-TDS08SGNNTR04; ComponentLink1Description: DataSheet; ComponentLink1URL: https://www.mouser.com.tr/datasheet/2/418/4/NG_DS_1-1773931-8_ALCOSWITCH_DIP_TDS_0917-1221113.pdf; ComponentLink2Description: Mouser; ComponentLink2URL: https://www.mouser.com.tr/ProductDetail/TE-Connectivity-Alcoswitch/TDS08SGNNTR04/?qs=wd5RIQLrsJiLOOX2pWoyQw==

## Sheet Digital Port A State LED Inducator.SchDoc: PORT State LED Inducator
size A3; ApprovedBy: Mehmet Günce Akkoyun; CheckedBy: Mehmet Günce Akkoyun; Author: Mehmet Günce Akkoyun; CompanyName: Ovoo Electronics; DrawnBy: Mehmet Günce Akkoyun; Engineer: Mehmet Günce Akkoyun; Organization: Ovoo Electronics; Address1: Necip Fazýl Mah. Ortaýrmak Sok.; Address2: Birgül Apt. No: 19/6; Address3: Meram / Konya; Address4: Turkiye; DocumentNumber: AA001; Revision: B100AA Dev Kit
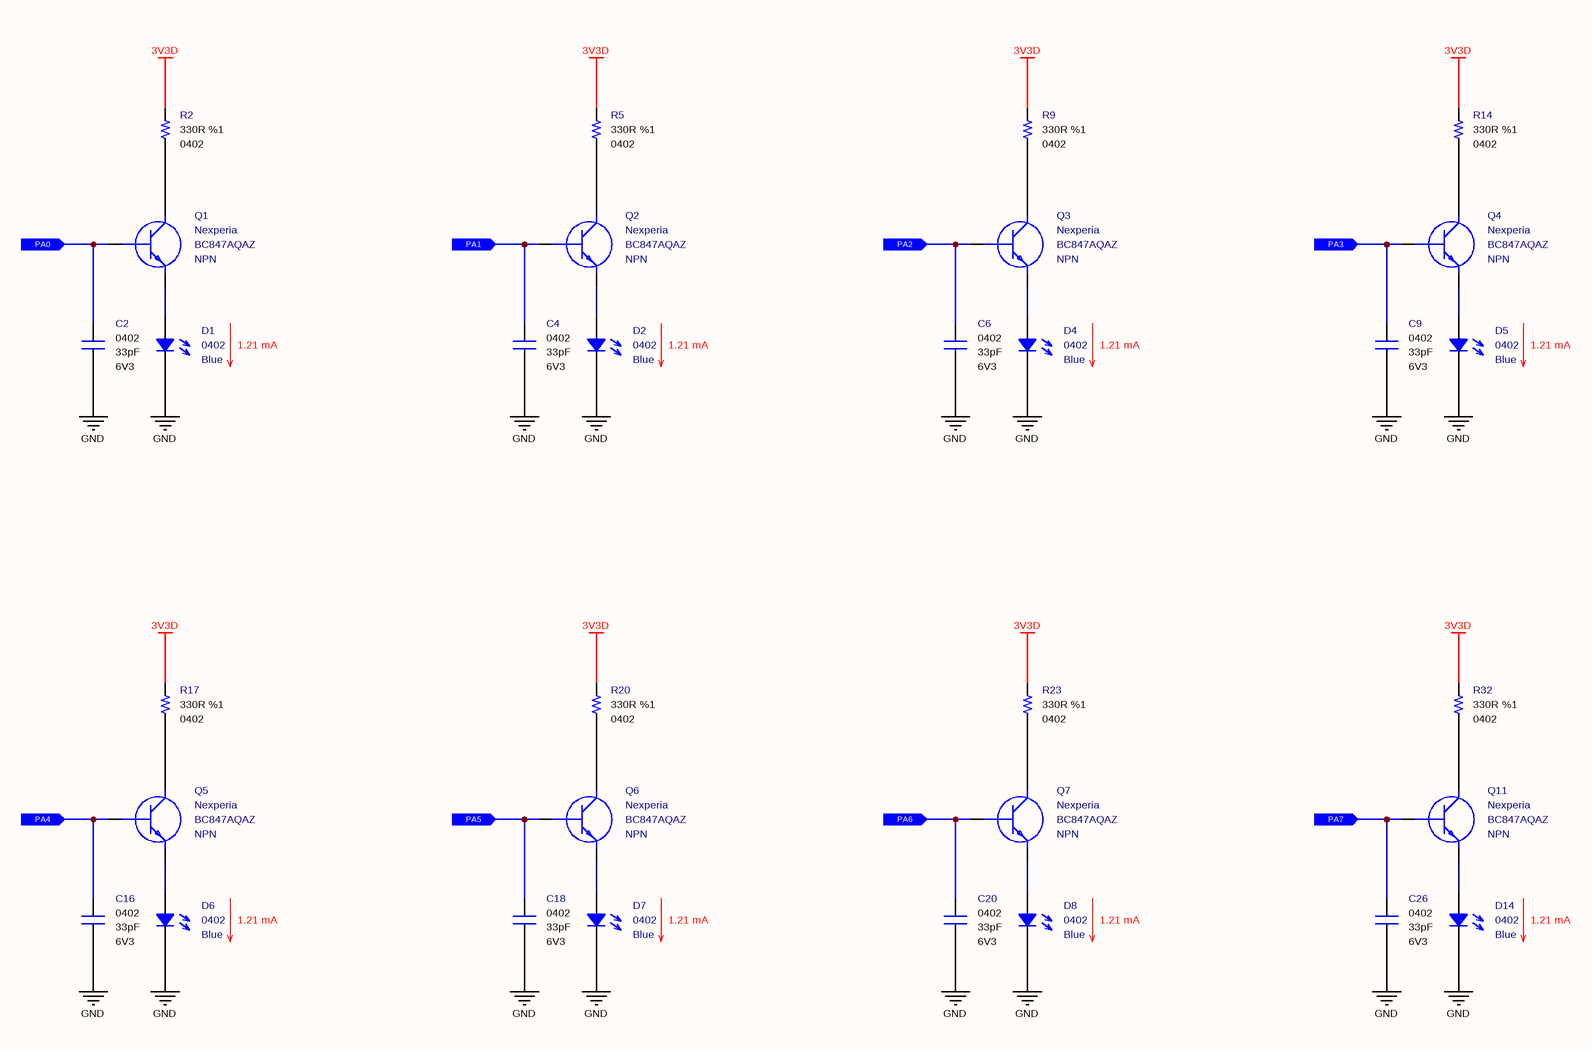
[diagram p4: Digital Port A State LED Inducator.SchDoc]

### Parts
C2  value 33pF  Case: 0402  Voltage: 6V3  [CAPACITOR_0402]  (hidden comment: Multilayer Ceramic Capacitor)
C4  value 33pF  Case: 0402  Voltage: 6V3  [CAPACITOR_0402]  (hidden comment: Multilayer Ceramic Capacitor)
C6  value 33pF  Case: 0402  Voltage: 6V3  [CAPACITOR_0402]  (hidden comment: Multilayer Ceramic Capacitor)
C9  value 33pF  Case: 0402  Voltage: 6V3  [CAPACITOR_0402]  (hidden comment: Multilayer Ceramic Capacitor)
C16  value 33pF  Case: 0402  Voltage: 6V3  [CAPACITOR_0402]  (hidden comment: Multilayer Ceramic Capacitor)
C18  value 33pF  Case: 0402  Voltage: 6V3  [CAPACITOR_0402]  (hidden comment: Multilayer Ceramic Capacitor)
C20  value 33pF  Case: 0402  Voltage: 6V3  [CAPACITOR_0402]  (hidden comment: Multilayer Ceramic Capacitor)
C26  value 33pF  Case: 0402  Voltage: 6V3  [CAPACITOR_0402]  (hidden comment: Multilayer Ceramic Capacitor)
D1  Case: 0402  Color: Blue  [LED_0402]  (hidden comment: SMD LED (Blue))
D2  Case: 0402  Color: Blue  [LED_0402]  (hidden comment: SMD LED (Blue))
D4  Case: 0402  Color: Blue  [LED_0402]  (hidden comment: SMD LED (Blue))
D5  Case: 0402  Color: Blue  [LED_0402]  (hidden comment: SMD LED (Blue))
D6  Case: 0402  Color: Blue  [LED_0402]  (hidden comment: SMD LED (Blue))
D7  Case: 0402  Color: Blue  [LED_0402]  (hidden comment: SMD LED (Blue))
D8  Case: 0402  Color: Blue  [LED_0402]  (hidden comment: SMD LED (Blue))
D14  Case: 0402  Color: Blue  [LED_0402]  (hidden comment: SMD LED (Blue))
Q1  Manufacturer_Name: Nexperia  Manufacturer_Part_Number: BC847AQAZ  Polarity: NPN  [SOT1215]  (hidden comment: Bipolar NPN Transistors)
Q2  Manufacturer_Name: Nexperia  Manufacturer_Part_Number: BC847AQAZ  Polarity: NPN  [SOT1215]  (hidden comment: Bipolar NPN Transistors)
Q3  Manufacturer_Name: Nexperia  Manufacturer_Part_Number: BC847AQAZ  Polarity: NPN  [SOT1215]  (hidden comment: Bipolar NPN Transistors)
Q4  Manufacturer_Name: Nexperia  Manufacturer_Part_Number: BC847AQAZ  Polarity: NPN  [SOT1215]  (hidden comment: Bipolar NPN Transistors)
Q5  Manufacturer_Name: Nexperia  Manufacturer_Part_Number: BC847AQAZ  Polarity: NPN  [SOT1215]  (hidden comment: Bipolar NPN Transistors)
Q6  Manufacturer_Name: Nexperia  Manufacturer_Part_Number: BC847AQAZ  Polarity: NPN  [SOT1215]  (hidden comment: Bipolar NPN Transistors)
Q7  Manufacturer_Name: Nexperia  Manufacturer_Part_Number: BC847AQAZ  Polarity: NPN  [SOT1215]  (hidden comment: Bipolar NPN Transistors)
Q11  Manufacturer_Name: Nexperia  Manufacturer_Part_Number: BC847AQAZ  Polarity: NPN  [SOT1215]  (hidden comment: Bipolar NPN Transistors)
R2  value 330R  Tolerance: %1  Case: 0402  [RESISTOR_0402]  (hidden comment: Thick Film Resistor)
R5  value 330R  Tolerance: %1  Case: 0402  [RESISTOR_0402]  (hidden comment: Thick Film Resistor)
R9  value 330R  Tolerance: %1  Case: 0402  [RESISTOR_0402]  (hidden comment: Thick Film Resistor)
R14  value 330R  Tolerance: %1  Case: 0402  [RESISTOR_0402]  (hidden comment: Thick Film Resistor)
R17  value 330R  Tolerance: %1  Case: 0402  [RESISTOR_0402]  (hidden comment: Thick Film Resistor)
R20  value 330R  Tolerance: %1  Case: 0402  [RESISTOR_0402]  (hidden comment: Thick Film Resistor)
R23  value 330R  Tolerance: %1  Case: 0402  [RESISTOR_0402]  (hidden comment: Thick Film Resistor)
R32  value 330R  Tolerance: %1  Case: 0402  [RESISTOR_0402]  (hidden comment: Thick Film Resistor)

### Ports
PA0 (in), PA1 (in), PA2 (in), PA3 (in), PA4 (in), PA5 (in), PA6 (in), PA7 (in)

### Nets
3V3D: R2.2 R5.2 R9.2 R14.2 R17.2 R20.2 R23.2 R32.2
GND: C2.2 C4.2 C6.2 C9.2 C16.2 C18.2 C20.2 C26.2 D1.1 D2.1 D4.1 D5.1 D6.1 D7.1 D8.1 D14.1
PA0: C2.1 Q1.1(B) ; port PA0
PA1: C4.1 Q2.1(B) ; port PA1
PA2: C6.1 Q3.1(B) ; port PA2
PA3: C9.1 Q4.1(B) ; port PA3
PA4: C16.1 Q5.1(B) ; port PA4
PA5: C18.1 Q6.1(B) ; port PA5
PA6: C20.1 Q7.1(B) ; port PA6
PA7: C26.1 Q11.1(B) ; port PA7
NetD1_2: D1.2 Q1.2(E)
NetD2_2: D2.2 Q2.2(E)
NetD4_2: D4.2 Q3.2(E)
NetD5_2: D5.2 Q4.2(E)
NetD6_2: D6.2 Q5.2(E)
NetD7_2: D7.2 Q6.2(E)
NetD8_2: D8.2 Q7.2(E)
NetD14_2: D14.2 Q11.2(E)
NetQ1_3: Q1.3(C) R2.1
NetQ2_3: Q2.3(C) R5.1
NetQ3_3: Q3.3(C) R9.1
NetQ4_3: Q4.3(C) R14.1
NetQ5_3: Q5.3(C) R17.1
NetQ6_3: Q6.3(C) R20.1
NetQ7_3: Q7.3(C) R23.1
NetQ11_3: Q11.3(C) R32.1

### Notes on the sheet
- 1.21 mA
- Title
- Size:
- Date:
- A3
- Number:
- Time:
- Revision:
- Sheet
- of
- File:

### Library data of the parts
C2 C4 C6 C9 C16 C18 C20 C26 = Capacitor - 33pF [0402-6V3]: Capacitor - 33pF [0402] (Ceramic); Manufacturer Name: Kemet; Manufacturer Part Number: C0402C330J9RACAUTO; Dielectric: X7R; Tolerance: 10%; Height: 0.5mm; Maximum Operating Temperature: +125; Minimum Operating Temperature: -55; ROHS: Yes; ComponentLink1Description: DataSheet; ComponentLink1URL: https://api.kemet.com/component-edge/download/datasheet/C0402C330J9RACAUTO.pdf; ComponentLink2Description: Mouser; ComponentLink2URL: https://www.mouser.com/Search/Refine.aspx?Keyword=80-C0402C330J9RAUTO; Supplier 1: Mouser; Supplier Part Number 1: 80-C0402C330J9RAUTO; Mouser Part Number: 80-C0402C330J9RAUTO
D1 D2 D4-D8 D14 = Diode - LED (0402-Blue): Standard LEDs - SMD PICOLEDTM;BLUE LED; 25M @ 5MA; Manufacturer_Name: ROHM Semiconductor; Manufacturer_Part_Number: SMLP13BC8TT86; Mouser_Part_Number: 755-SMLP13BC8TT86; ROHS: Yes; ComponentLink1Description: DataSheet; ComponentLink1URL: https://d1d2qsbl8m0m72.cloudfront.net/en/products/databook/datasheet/opto/led/chip_mono/sml-p1-e.pdf; ComponentLink2Description: Mouser; ComponentLink2URL: https://www.mouser.com.tr/ProductDetail/ROHM-Semiconductor/SMLP13BC8TT86?qs=%2Fha2pyFaduidYDgXFKL%252BNZwCVZNUI4FlyPWWbVDx1b6ABmzS%252BS2f0w%3D%3D; Supplier 1: Mouser; Supplier 2: Digi-Key; Supplier Part Number 1: 755-SMLP13BC8TT86; Supplier Part Number 2: 846-1112-1-ND
Q1-Q7 Q11 = Transistor - BC847: Bipolar Transistors - BJT BC847AQA/DFN1010D-3/REEL 7" Q2; Mouser_Part_Number: 771-BC847AQAZ; ComponentLink1Description: DataSheet; ComponentLink1URL: https://www.mouser.com.tr/datasheet/2/916/BC847XQA_SER-1598405.pdf; ComponentLink2Description: Mouser; ComponentLink2URL: https://www.mouser.com.tr/ProductDetail/Nexperia/BC847AQAZ?qs=%2Fha2pyFaduhKMCPKNtQimeJpXTw9z4AqURd2YARs8DVICZNv3AT9Dw%3D%3D; Case: DFN-1010D-3; Supplier 1: Mouser; Supplier 2: Digi-Key; Supplier Part Number 1: 771-BC847AQAZ; Supplier Part Number 2: 1727-2545-1-ND
R2 R5 R9 R14 R17 R20 R23 R32 = Resistor - 330R: Thick Film Resistors - SMD 1/16 W 330 Ohm 1%; Manufacturer Name: Vishay; Manufacturer Part Number: CRCW0402330RFKED; Height: 0.4mm; ComponentLink1Description: DataSheet; ComponentLink1URL: https://www.mouser.com.tr/datasheet/2/427/dcrcwe3-1762152.pdf; ComponentLink2Description: Mouser; ComponentLink2URL: https://www.mouser.com.tr/ProductDetail/Vishay-Dale/CRCW0402330RFKED?qs=sGAEpiMZZMu61qfTUdNhG2DpbjADlD3GGS6SwBlLi5Q%3D; Supplier 1: Mouser; Supplier 2: Digi-Key; Supplier Part Number 2: 541-330LCT-ND; Supplier Part Number 1: 71-CRCW0402-330-E3; Mouser Part Number: 71-CRCW0402-330-E3

## Sheet Digital Port A Button.SchDoc: PORT State Change Buttons
size A4; ApprovedBy: Mehmet Günce Akkoyun; CheckedBy: Mehmet Günce Akkoyun; Author: Mehmet Günce Akkoyun; CompanyName: Ovoo Electronics; DrawnBy: Mehmet Günce Akkoyun; Engineer: Mehmet Günce Akkoyun; Organization: Ovoo Electronics; Address1: Necip Fazýl Mah. Ortaýrmak Sok.; Address2: Birgül Apt. No: 19/6; Address3: Meram / Konya; Address4: Turkiye; DocumentNumber: AA001; Revision: B100AA Dev Kit
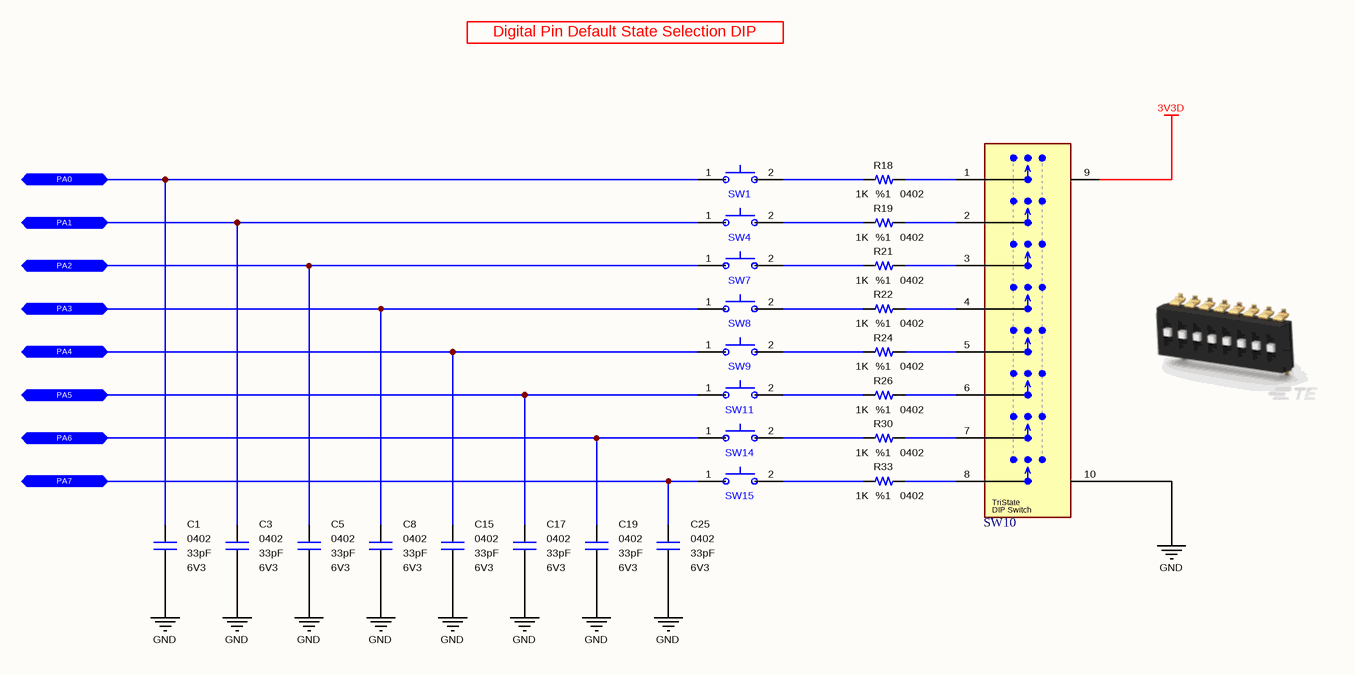
[diagram p5: Digital Port A Button.SchDoc]

### Parts
C1  value 33pF  Case: 0402  Voltage: 6V3  [CAPACITOR_0402]  (hidden comment: Multilayer Ceramic Capacitor)
C3  value 33pF  Case: 0402  Voltage: 6V3  [CAPACITOR_0402]  (hidden comment: Multilayer Ceramic Capacitor)
C5  value 33pF  Case: 0402  Voltage: 6V3  [CAPACITOR_0402]  (hidden comment: Multilayer Ceramic Capacitor)
C8  value 33pF  Case: 0402  Voltage: 6V3  [CAPACITOR_0402]  (hidden comment: Multilayer Ceramic Capacitor)
C15  value 33pF  Case: 0402  Voltage: 6V3  [CAPACITOR_0402]  (hidden comment: Multilayer Ceramic Capacitor)
C17  value 33pF  Case: 0402  Voltage: 6V3  [CAPACITOR_0402]  (hidden comment: Multilayer Ceramic Capacitor)
C19  value 33pF  Case: 0402  Voltage: 6V3  [CAPACITOR_0402]  (hidden comment: Multilayer Ceramic Capacitor)
C25  value 33pF  Case: 0402  Voltage: 6V3  [CAPACITOR_0402]  (hidden comment: Multilayer Ceramic Capacitor)
R18  value 1K  Tolerance: %1  Case: 0402  [RESISTOR_0402]  (hidden comment: Thick Film Resistor)
R19  value 1K  Tolerance: %1  Case: 0402  [RESISTOR_0402]  (hidden comment: Thick Film Resistor)
R21  value 1K  Tolerance: %1  Case: 0402  [RESISTOR_0402]  (hidden comment: Thick Film Resistor)
R22  value 1K  Tolerance: %1  Case: 0402  [RESISTOR_0402]  (hidden comment: Thick Film Resistor)
R24  value 1K  Tolerance: %1  Case: 0402  [RESISTOR_0402]  (hidden comment: Thick Film Resistor)
R26  value 1K  Tolerance: %1  Case: 0402  [RESISTOR_0402]  (hidden comment: Thick Film Resistor)
R30  value 1K  Tolerance: %1  Case: 0402  [RESISTOR_0402]  (hidden comment: Thick Film Resistor)
R33  value 1K  Tolerance: %1  Case: 0402  [RESISTOR_0402]  (hidden comment: Thick Film Resistor)
SW1  Tactile Switches  [PTS526_Switch]  (value not drawn)
SW4  Tactile Switches  [PTS526_Switch]  (value not drawn)
SW7  Tactile Switches  [PTS526_Switch]  (value not drawn)
SW8  Tactile Switches  [PTS526_Switch]  (value not drawn)
SW9  Tactile Switches  [PTS526_Switch]  (value not drawn)
SW10  DIP Switches/SIP Switches  [TDS08SGNNTR04]  (value not drawn)
SW11  Tactile Switches  [PTS526_Switch]  (value not drawn)
SW14  Tactile Switches  [PTS526_Switch]  (value not drawn)
SW15  Tactile Switches  [PTS526_Switch]  (value not drawn)

### Ports
PA0 (bidir), PA1 (bidir), PA2 (bidir), PA3 (bidir), PA4 (bidir), PA5 (bidir), PA6 (bidir), PA7 (bidir)

### Nets
3V3D: SW10.9(VCC)
GND: C1.1 C3.1 C5.1 C8.1 C15.1 C17.1 C19.1 C25.1 SW10.10(GND)
PA0: C1.2 SW1.1(NC) ; port PA0
PA1: C3.2 SW4.1(NC) ; port PA1
PA2: C5.2 SW7.1(NC) ; port PA2
PA3: C8.2 SW8.1(NC) ; port PA3
PA4: C15.2 SW9.1(NC) ; port PA4
PA5: C17.2 SW11.1(NC) ; port PA5
PA6: C19.2 SW14.1(NC) ; port PA6
PA7: C25.2 SW15.1(NC) ; port PA7
NetR18_1: R18.1 SW10.1
NetR18_2: R18.2 SW1.2(COM)
NetR19_1: R19.1 SW10.2
NetR19_2: R19.2 SW4.2(COM)
NetR21_1: R21.1 SW10.3
NetR21_2: R21.2 SW7.2(COM)
NetR22_1: R22.1 SW10.4
NetR22_2: R22.2 SW8.2(COM)
NetR24_1: R24.1 SW10.5
NetR24_2: R24.2 SW9.2(COM)
NetR26_1: R26.1 SW10.6
NetR26_2: R26.2 SW11.2(COM)
NetR30_1: R30.1 SW10.7
NetR30_2: R30.2 SW14.2(COM)
NetR33_1: R33.1 SW10.8
NetR33_2: R33.2 SW15.2(COM)

### Notes on the sheet
- Digital Pin Default State Selection DIP
- Title
- Size:
- Date:
- A4
- Number:
- Time:
- Revision:
- Sheet
- of
- File:
- (in symbol Switch - DIP Switch (8 Pole TriState)) TriState; DIP Switch

### Library data of the parts
C1 C3 C5 C8 C15 C17 C19 C25 = Capacitor - 33pF [0402-6V3]: as C2 on sheet Digital Port A State LED Inducator; Height: 0.5mm; Mouser Part Number: 80-C0402C330J9RAUTO; Maximum Operating Temperature: +125; Minimum Operating Temperature: -55; ROHS: Yes; ComponentLink1Description: DataSheet; ComponentLink1URL: https://api.kemet.com/component-edge/download/datasheet/C0402C330J9RACAUTO.pdf; ComponentLink2Description: Mouser; ComponentLink2URL: https://www.mouser.com/Search/Refine.aspx?Keyword=80-C0402C330J9RAUTO; Supplier 1: Mouser; Supplier Part Number 1: 80-C0402C330J9RAUTO
R18 R19 R21 R22 R24 R26 R30 R33 = Resistor - 1K: Thick Film Resistors - SMD 1/16 W 1.0 Kohms 1%; Manufacturer Name: Vishay; Manufacturer Part Number: CRCW04021K00FKED; Height: 0.35mm; Mouser Part Number: 71-CRCW0402-1.0K-E3; ComponentLink1Description: DataSheet; ComponentLink1URL: https://www.mouser.com.tr/datasheet/2/427/dcrcwe3-1762152.pdf; ComponentLink2Description: Mouser; ComponentLink2URL: https://www.mouser.com.tr/ProductDetail/Vishay-Dale/CRCW04021K00FKED?qs=sGAEpiMZZMu61qfTUdNhG2DpbjADlD3GFJ4zSbeLqG8%3D; Supplier 1: Mouser; Supplier 2: Digi-Key; Supplier Part Number 1: 71-CRCW0402-1.0K-E3; Supplier Part Number 2: 541-1.00KLCT-ND
SW1 SW4 SW7-SW9 SW11 SW14 SW15 = Switch - Tactile: Tactile Switches 50mA 12VDC, 5.2x5.2mm, 0.8mm H, 260gf, G leads.; Manufacturer Name: C&K Switches; Manufacturer Part Number: PTS526 SK08 SMTR2 LFS; Height: 0.8mm; Mouser Part Number: 611-PTS526SK08SMTR2L; ComponentLink1Description: DataSheet; ComponentLink1URL: https://eu.mouser.com/datasheet/2/60/pts526-1651200.pdf; ComponentLink2Description: Mouser; ComponentLink2URL: https://eu.mouser.com/ProductDetail/CK/PTS526-SK08-SMTR2-LFS?qs=sGAEpiMZZMsgGjVA3toVBL%2FRce%252ByN3s1hQPqiLlQ%252BeM%3D; Supplier 1: Future Electronics; Supplier 2: Mouser; Supplier 3: Arrow; Supplier 4: Digi-Key; Supplier Part Number 1: PTS526SK08SMTR2LFS-REEL; Supplier Part Number 2: 611-PTS526SK08SMTR2L; Supplier Part Number 3: PTS526 SK08 SMTR2 LFS; Supplier Part Number 4: CKN12219-1-ND
SW10 = Switch - DIP Switch (8 Pole TriState): as SW2 on sheet Digital Port A Default State DIP; Manufacturer Part Number: TDS08SGNNTR04; Mouser Part Number: 506-TDS08SGNNTR04; ComponentLink1Description: DataSheet; ComponentLink1URL: https://www.mouser.com.tr/datasheet/2/418/4/NG_DS_1-1773931-8_ALCOSWITCH_DIP_TDS_0917-1221113.pdf; ComponentLink2Description: Mouser; ComponentLink2URL: https://www.mouser.com.tr/ProductDetail/TE-Connectivity-Alcoswitch/TDS08SGNNTR04/?qs=wd5RIQLrsJiLOOX2pWoyQw==

## Sheet Digital Port C.SchDoc: Port C Digital Control
size A4; ApprovedBy: Mehmet Günce Akkoyun; CheckedBy: Mehmet Günce Akkoyun; Author: Mehmet Günce Akkoyun; CompanyName: Ovoo Electronics; DrawnBy: Mehmet Günce Akkoyun; Engineer: Mehmet Günce Akkoyun; Organization: Ovoo Electronics; Address1: Necip Fazýl Mah. Ortaýrmak Sok.; Address2: Birgül Apt. No: 19/6; Address3: Meram / Konya; Address4: Turkiye; DocumentNumber: AA001; Revision: B100AA Dev Kit
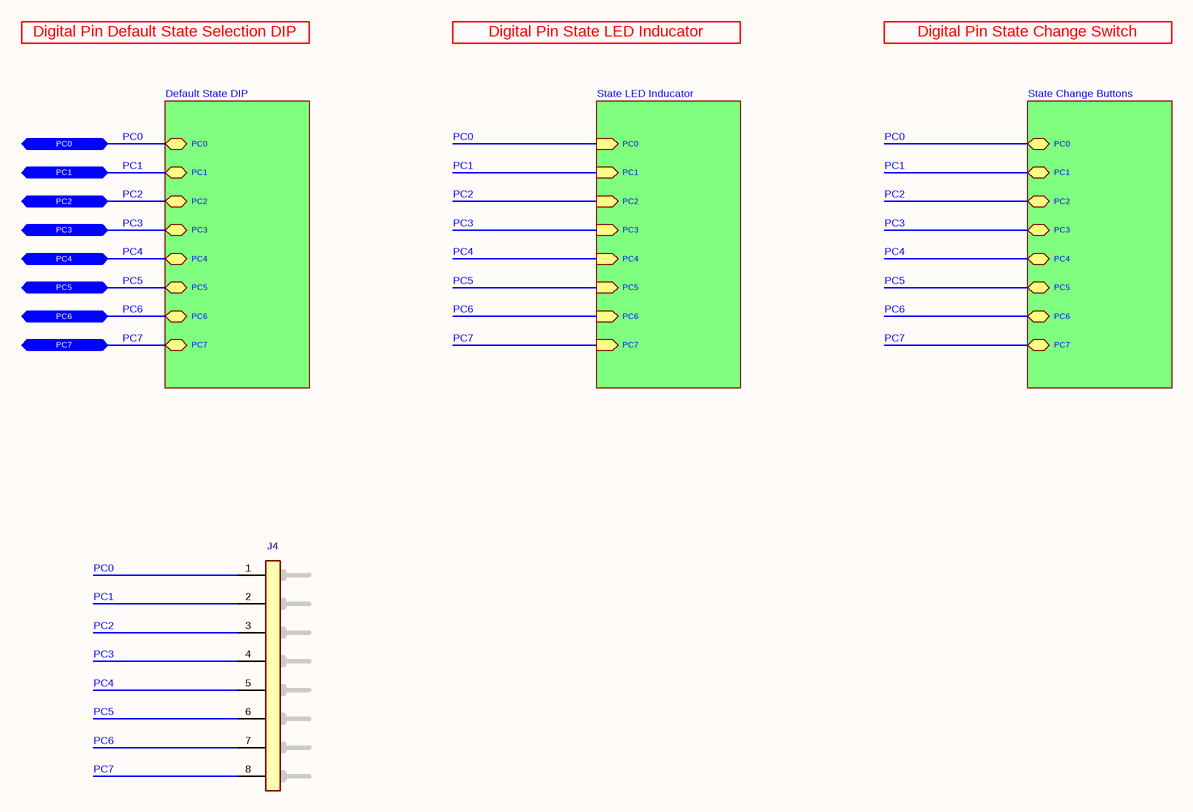
[diagram p6: Digital Port C.SchDoc]

### Parts
J4  2.54 mm Pitch 8P Male Connector  [8P Header]  (value not drawn)

### Sub-sheets
Default State DIP = Digital Port C Default State DIP.SchDoc: PC1 (bidir), PC0 (bidir), PC7 (bidir), PC4 (bidir), PC6 (bidir), PC3 (bidir), PC5 (bidir), PC2 (bidir)
State Change Buttons = Digital Port C Button.SchDoc: PC1 (bidir), PC0 (bidir), PC7 (bidir), PC4 (bidir), PC6 (bidir), PC3 (bidir), PC5 (bidir), PC2 (bidir)
State LED Inducator = Digital Port C State LED Inducator.SchDoc: PC1 (in), PC0 (in), PC7 (in), PC4 (in), PC6 (in), PC3 (in), PC5 (in), PC2 (in)

### Ports
PC0 (bidir), PC1 (bidir), PC2 (bidir), PC3 (bidir), PC4 (bidir), PC5 (bidir), PC6 (bidir), PC7 (bidir)

### Nets
PC0: J4.1(Pin-1) ; port PC0, sheet Default State DIP/PC0, sheet State LED Inducator/PC0, sheet State Change Buttons/PC0
PC1: J4.2(Pin-2) ; port PC1, sheet Default State DIP/PC1, sheet State LED Inducator/PC1, sheet State Change Buttons/PC1
PC2: J4.3(Pin-3) ; port PC2, sheet Default State DIP/PC2, sheet State LED Inducator/PC2, sheet State Change Buttons/PC2
PC3: J4.4(Pin-4) ; port PC3, sheet Default State DIP/PC3, sheet State LED Inducator/PC3, sheet State Change Buttons/PC3
PC4: J4.5(Pin-5) ; port PC4, sheet Default State DIP/PC4, sheet State LED Inducator/PC4, sheet State Change Buttons/PC4
PC5: J4.6(Pin-6) ; port PC5, sheet Default State DIP/PC5, sheet State LED Inducator/PC5, sheet State Change Buttons/PC5
PC6: J4.7(Pin-7) ; port PC6, sheet Default State DIP/PC6, sheet State LED Inducator/PC6, sheet State Change Buttons/PC6
PC7: J4.8(Pin-8) ; port PC7, sheet Default State DIP/PC7, sheet State LED Inducator/PC7, sheet State Change Buttons/PC7

### Notes on the sheet
- Digital Pin Default State Selection DIP
- Digital Pin State LED Inducator
- Digital Pin State Change Switch
- Title
- Size:
- Date:
- A4
- Number:
- Time:
- Revision:
- Sheet
- of
- File:

### Library data of the parts
J4 = Connector - Male Header 8P (2.54): as J2 on sheet Digital Port A; Manufacturer Part Number: 22-28-4083; Mouser Part Number: 538-22-28-4083; ROHS: Yes; ComponentLink1Description: DataSheet; ComponentLink1URL: https://www.mouser.com.tr/datasheet/2/276/0022284063_PCB_HEADERS-228265.pdf; ComponentLink2Description: Mouser; ComponentLink2URL: https://www.mouser.com.tr/ProductDetail/Molex/22-28-4083/?qs=%2Fha2pyFaduguMWEp6M%252Bj0x6fHxUvnRGD%252BIxBoa6MO5w%3D

## Sheet Digital Port C Default State DIP.SchDoc: PORT C Default State Selection Switch
size A4; ApprovedBy: Mehmet Günce Akkoyun; CheckedBy: Mehmet Günce Akkoyun; Author: Mehmet Günce Akkoyun; CompanyName: Ovoo Electronics; DrawnBy: Mehmet Günce Akkoyun; Engineer: Mehmet Günce Akkoyun; Organization: Ovoo Electronics; Address1: Necip Fazýl Mah. Ortaýrmak Sok.; Address2: Birgül Apt. No: 19/6; Address3: Meram / Konya; Address4: Turkiye; DocumentNumber: AA001; Revision: B100AA Dev Kit
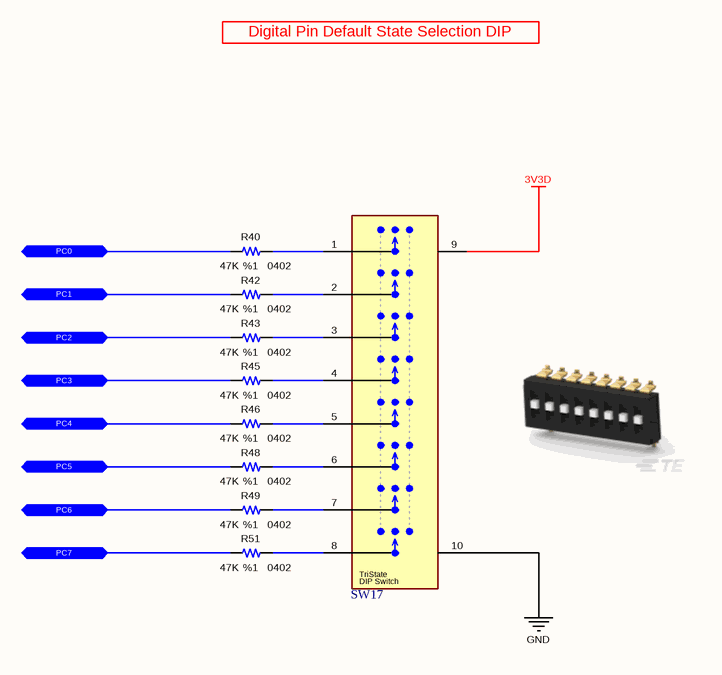
[diagram p7: Digital Port C Default State DIP.SchDoc]

### Parts
R40  value 47K  Tolerance: %1  Case: 0402  [RESISTOR_0402]  (hidden comment: Thick Film Resistor)
R42  value 47K  Tolerance: %1  Case: 0402  [RESISTOR_0402]  (hidden comment: Thick Film Resistor)
R43  value 47K  Tolerance: %1  Case: 0402  [RESISTOR_0402]  (hidden comment: Thick Film Resistor)
R45  value 47K  Tolerance: %1  Case: 0402  [RESISTOR_0402]  (hidden comment: Thick Film Resistor)
R46  value 47K  Tolerance: %1  Case: 0402  [RESISTOR_0402]  (hidden comment: Thick Film Resistor)
R48  value 47K  Tolerance: %1  Case: 0402  [RESISTOR_0402]  (hidden comment: Thick Film Resistor)
R49  value 47K  Tolerance: %1  Case: 0402  [RESISTOR_0402]  (hidden comment: Thick Film Resistor)
R51  value 47K  Tolerance: %1  Case: 0402  [RESISTOR_0402]  (hidden comment: Thick Film Resistor)
SW17  DIP Switches/SIP Switches  [TDS08SGNNTR04]  (value not drawn)

### Ports
PC0 (bidir), PC1 (bidir), PC2 (bidir), PC3 (bidir), PC4 (bidir), PC5 (bidir), PC6 (bidir), PC7 (bidir)

### Nets
3V3D: SW17.9(VCC)
GND: SW17.10(GND)
PC0: R40.2 ; port PC0
PC1: R42.2 ; port PC1
PC2: R43.2 ; port PC2
PC3: R45.2 ; port PC3
PC4: R46.2 ; port PC4
PC5: R48.2 ; port PC5
PC6: R49.2 ; port PC6
PC7: R51.2 ; port PC7
NetR40_1: R40.1 SW17.1
NetR42_1: R42.1 SW17.2
NetR43_1: R43.1 SW17.3
NetR45_1: R45.1 SW17.4
NetR46_1: R46.1 SW17.5
NetR48_1: R48.1 SW17.6
NetR49_1: R49.1 SW17.7
NetR51_1: R51.1 SW17.8

### Notes on the sheet
- Digital Pin Default State Selection DIP
- Title
- Size:
- Date:
- A4
- Number:
- Time:
- Revision:
- Sheet
- of
- File:
- (in symbol Switch - DIP Switch (8 Pole TriState)) TriState; DIP Switch

### Library data of the parts
R40 R42 R43 R45 R46 R48 R49 R51 = Resistor - 47K: as R1 on sheet Digital Port A Default State DIP; Height: 0.4mm; Mouser Part Number: 71-CRCW0402-47K-E3; ComponentLink1Description: DataSheet; ComponentLink1URL: https://www.mouser.com.tr/datasheet/2/427/dcrcwe3-1762152.pdf; ComponentLink2Description: Mouser; ComponentLink2URL: https://www.mouser.com.tr/ProductDetail/Vishay-Dale/CRCW040247K0FKED?qs=sGAEpiMZZMu61qfTUdNhG2DpbjADlD3GL%252B3h1elTxqU%3D; Supplier 1: Mouser; Supplier 2: Digi-Key; Supplier Part Number 1: 71-CRCW040247K0FKEDH; Supplier Part Number 2: 541-47.0KYCT-ND
SW17 = Switch - DIP Switch (8 Pole TriState): as SW2 on sheet Digital Port A Default State DIP; Manufacturer Part Number: TDS08SGNNTR04; Mouser Part Number: 506-TDS08SGNNTR04; ComponentLink1Description: DataSheet; ComponentLink1URL: https://www.mouser.com.tr/datasheet/2/418/4/NG_DS_1-1773931-8_ALCOSWITCH_DIP_TDS_0917-1221113.pdf; ComponentLink2Description: Mouser; ComponentLink2URL: https://www.mouser.com.tr/ProductDetail/TE-Connectivity-Alcoswitch/TDS08SGNNTR04/?qs=wd5RIQLrsJiLOOX2pWoyQw==